# EAGLE schematic main (EAGLE 8.3.2)
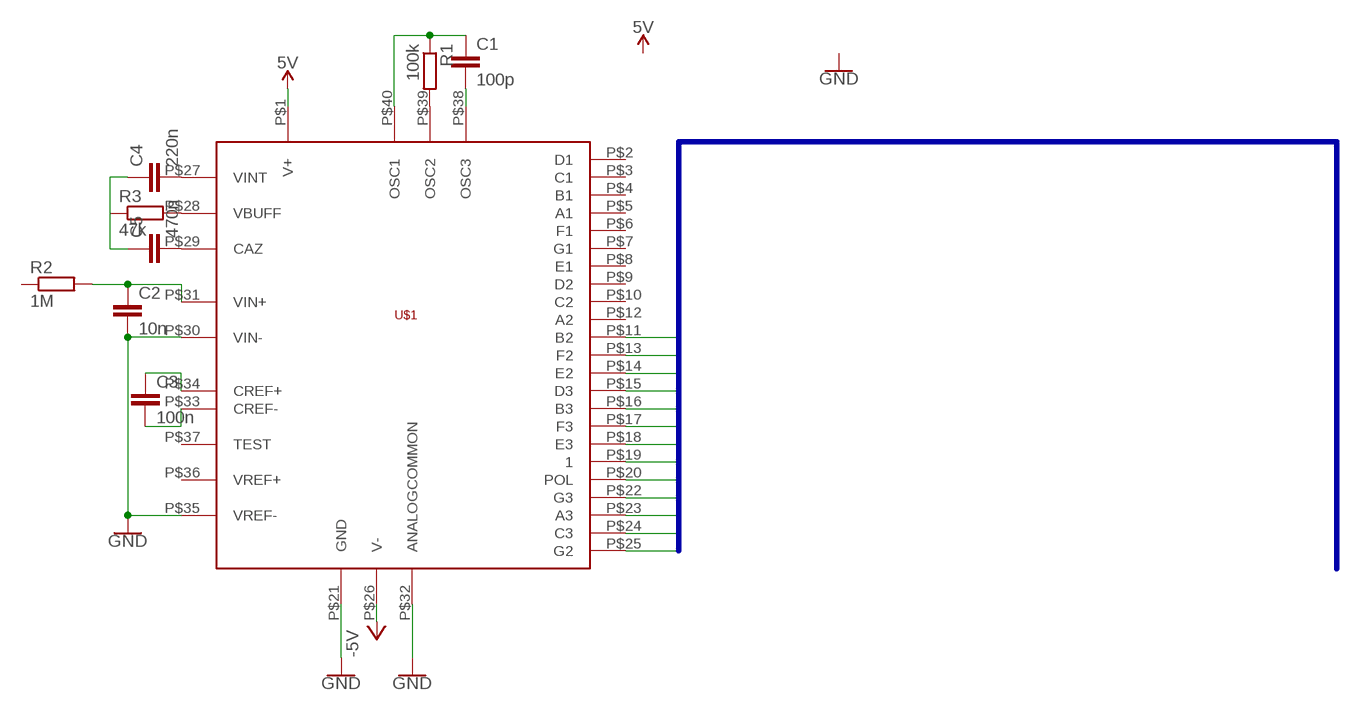
[diagram p0: schematic, sheet 1]

## Parts
C1  100p  C-EU025-025X050  [C025-025X050]
C2  10n  C-EU025-025X050  [C025-025X050]
C3  100n  C-EU025-025X050  [C025-025X050]
C4  220n  C-EU025-025X050  [C025-025X050]
C5  470n  C-EU025-025X050  [C025-025X050]
R1  100k  R-EU_0204/7  [0204/7]
R2  1M  R-EU_0204/7  [0204/7]
R3  47k  R-EU_0204/7  [0204/7]
U$1  TC7107  [DIP40]

## Nets
1: U$1.P$19
5V: U$1.P$1(V+)
-5V: U$1.P$26(V-)
A3: U$1.P$23(A3)
B2: U$1.P$11(B2)
B3: U$1.P$16(B3)
C3: U$1.P$24(C3)
D3: U$1.P$15(D3)
E2: U$1.P$14(E2)
E3: U$1.P$18(E3)
F2: U$1.P$13(F2)
F3: U$1.P$17(F3)
G2: U$1.P$25(G2)
G3: U$1.P$22(G3)
GND: C2.2 U$1.P$21(GND) U$1.P$30(VIN-) U$1.P$32(ANALOGCOMMON) U$1.P$35(VREF-)
N$1: C3.1 U$1.P$34(CREF+)
N$2: C2.1 R2.2 U$1.P$31(VIN+)
N$3: R1.2 U$1.P$39(OSC2)
N$4: C1.1 R1.1 U$1.P$40(OSC1)
N$5: C1.2 U$1.P$38(OSC3)
N$6: C3.2 U$1.P$33(CREF-)
N$7: C4.2 U$1.P$27(VINT)
N$8: C5.2 U$1.P$29(CAZ)
N$9: R3.2 U$1.P$28(VBUFF)
N$10: C4.1 C5.1
POL: U$1.P$20(POL)
Unconnected: R2.1 R3.1 U$1.P$2(D1) U$1.P$3(C1) U$1.P$4(B1) U$1.P$5(A1) U$1.P$6(F1) U$1.P$7(G1) U$1.P$8(E1) U$1.P$9(D2) U$1.P$10(C2) U$1.P$12(A2) U$1.P$36(VREF+) U$1.P$37(TEST)

## Buses
A[1..3],B[1..3],C[1..3],D[1..3],E[1..3],F[1..3],G[1..3],1,POL

## Library data of the parts
C1-C5 = rcl:C-EU: CAPACITOR, European symbol
R1-R3 = rcl:R-EU_: RESISTOR, European symbol
U$1 = 7_segment_lib:TC7107